# Altium schematic sheet PWR_PROT.SchDoc
size A4; SheetNumber: 5; SheetTotal: 6
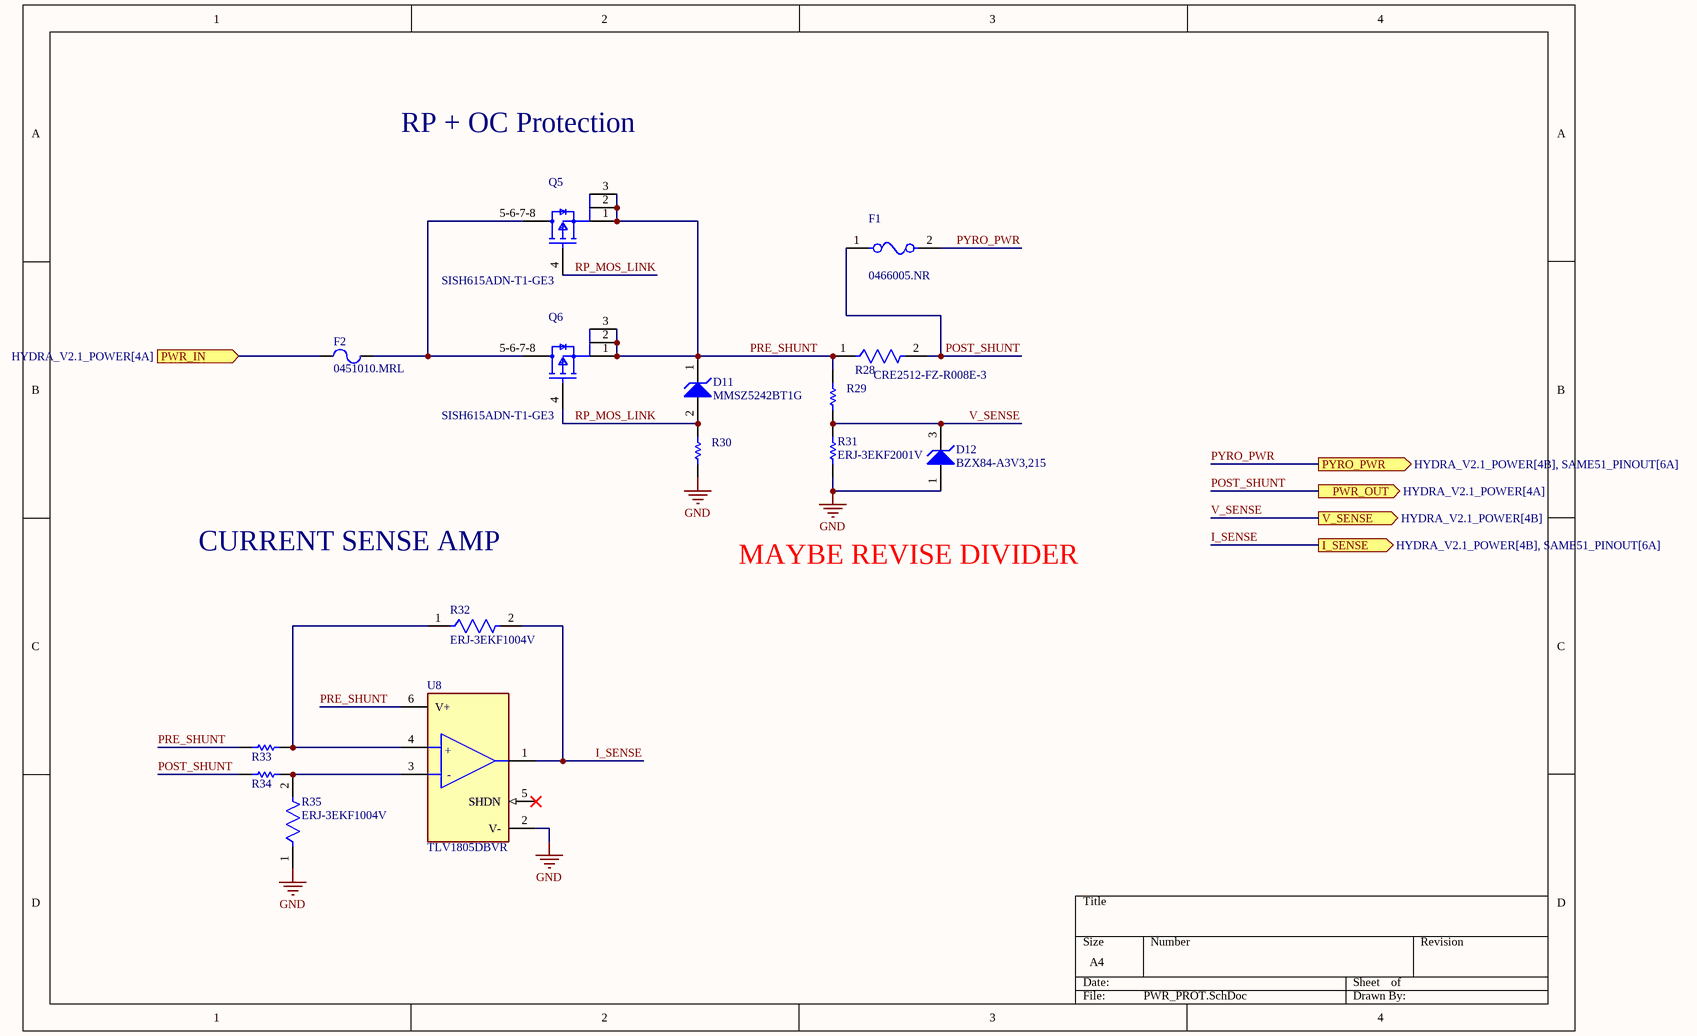
[diagram p0: PWR_PROT.SchDoc]

## Parts
D11  MMSZ5242BT1G  [ONSC-SOD-123-2-425-04_V]
D12  BZX84-A3V3,215  [SOT95P230X110-3N]
F1  0466005.NR  [FP-0466-MFG]
F2  0451010.MRL  [LFUS-45X_V]
Q5  SISH615ADN-T1-GE3  [SISH615ADN-T1-GE3-Footprint-1]
Q6  SISH615ADN-T1-GE3  [SISH615ADN-T1-GE3-Footprint-1]
R28  CRE2512-FZ-R008E-3  [CRF2512-FZ-R005ELF-Footprint-1]
R29  ERJ3EKF1002V  [RESC1609X55X30LL15T15]  (value not drawn)
R30  ERJ3EKF1002V  [RESC1609X55X30LL15T15]  (value not drawn)
R31  ERJ-3EKF2001V  [RESC1608X55X30ML15T15]
R32  ERJ-3EKF1004V  [FP-ERJ3EK-IPC_C]
R33  ERJ3EKF1002V  [RESC1609X55X30LL15T15]  (value not drawn)
R34  ERJ3EKF1002V  [RESC1609X55X30LL15T15]  (value not drawn)
R35  ERJ-3EKF1004V  [FP-ERJ3EK-IPC_C]
U8  TLV1805DBVR  [FP-DBV0006A-IPC_C]

## Ports
I_SENSE (out, see HYDRA_V2.1_POWER[4B], SAME51_PINOUT[6A]), PWR_IN (in, see HYDRA_V2.1_POWER[4A]), PWR_OUT (out, see HYDRA_V2.1_POWER[4A]), PYRO_PWR (out, see HYDRA_V2.1_POWER[4B], SAME51_PINOUT[6A]), V_SENSE (out, see HYDRA_V2.1_POWER[4B])

## Nets
GND: D12.1(A) R30.2 R31.1 R35.1 U8.2(V-)
I_SENSE: R32.2 U8.1(OUT) ; port I_SENSE
POST_SHUNT: F1.1 R28.2 R34.1 ; port PWR_OUT
PRE_SHUNT: D11.1(K) Q5.1(S) Q5.2(S) Q5.3(S) Q6.1(S) Q6.2(S) Q6.3(S) R28.1 R29.1 R33.1 U8.6(V+)
PWR_IN: F2.1 ; port PWR_IN
PYRO_PWR: F1.2 ; port PYRO_PWR
RP_MOS_LINK: D11.2(A) Q5.4(G) Q6.4(G) R30.1
V_SENSE: D12.3(K) R29.2 R31.2 ; port V_SENSE
NetF2_2: F2.2 Q5.5-6-7-8(D) Q6.5-6-7-8(D)
NetR32_1: R32.1 R33.2 U8.4(+IN)
NetR34_2: R34.2 R35.2 U8.3(-IN)

Not connected (* = marked no-connect by the designer): U8 5(SHDN)*

## Notes on the sheet
- RP + OC Protection
- CURRENT SENSE AMP
- MAYBE REVISE DIVIDER
- (in symbol CMP-04896-000098-1) +; -

## Library data of the parts
D11 = CMP-1060-00565-1: Zener Voltage Regulator, 500 mW, 2-Pin SOD-123, Pb-Free, Tape and Reel; Manufacturer: On Semiconductor; P Max (W): 0.5; VZ Typ (V): 12; PartNumber: MMSZ5242BT1G; PackageReference: SOD-123-2-425-04; ComponentLink3URL: http://www.onsemi.com/pub_link/Collateral/425-04.PDF; Mounting Technology: Surface Mount; ComponentLink2Description: Datasheet; ComponentLink1URL: http://www.onsemi.com/; ComponentLink3Description: Package Specification; PackageDescription: 2-Pin SOD, Body 1.6 x 2.69 mm; PackageVersion: Rev. G, 10/2009; ComponentLink1Description: Manufacturer URL; RoHS: Pb-Free; ComponentLink2URL: http://www.onsemi.com/pub_link/Collateral/MMSZ5221BT1-D.PDF; Packing: Tape and Reel; DatasheetVersion: Rev. 12
D12 = CMP-004-00035-1: DIODE ZENER 3.3V 250MW SOT23
F1 = CMP-08605-000032-1: FUSE BOARD MNT 5A 32VAC/VDC 1206; Manufacturer: Littelfuse Inc; Value: 0.011Ω; Max Fuse Ac Voltage: 32V; Fuse I2T: 2.5A2Sec; Fuse Interrupt Ac Current: 50A; Fuse Blow Speed: Fast; Fuse Voltage Drop: 73.75mV; Category: Fuse; Temperature: -55°C to +90°C; Lead Free: Yes; Temperature Range High: +90°C; RoHS: TRUE; Device Class L2: Fuses; ComponentLink2URL: https://www.littelfuse.com/~/media/electronics/datasheets/fuses/littelfuse_fuse_466_datasheet.pdf.pdf; Fuse Current: 5A; Octopart: https://octopart.com/0466005.nr-littelfuse-143206; Automotive: No; Max Fuse Dc Voltage: 32V; Temperature Range Low: -55°C; Device Class L3: unset; ComponentLink2Description: Datasheet; Manufacturer Part Number: 0466005.NR; Fuse Interrupt Dc Current: 50A; Resistance: 0.011Ω; Package: 0466; Device Class L1: Circuit Protection; Mouser Description: Surface Mount Fuses 32V 5A VFA Slimline; Height: 0.66mm; Voltage Rating: 32V; Digikey Description: FUSE BOARD MNT 5A 32VAC/VDC 1206
F2 = CMP-2000-05664-1: Fuse, 125 V, 10 A, -55 to 125 degC, 2-Pin SMD, RoHS, Tape and Reel; Manufacturer: Littelfuse; Working Voltage-Max: 125V; Response Characteristic: VeryFastActing; Current Rating: 10A; Manufacturer URL: http://www.littelfuse.com/; Mounting Technology: SurfaceMount; Size: 6.10x2.69mm; Operating Temp Range: -55to+125°C; Package Description: 2-Pin Surface Mount Device, Body 6.1 x 2.69 mm; Package Reference: 45X; Datasheet Version: 02/2016; Datasheet URL: http://www.littelfuse.com/products/fuses/surface-mount-fuses/nano-2-fuses/~/media/electronics/datasheets/fuses/littelfuse_fuse_451_453_datasheet.pdf.pdf
Q5 Q6 = CMP-013-00036-2: Trans MOSFET P-CH 20V 22.1A 8-Pin PowerPAK 1212 EP T/R
R28 = CMP-009-00183-1: Actually https://www.digikey.ca/en/products/detail/bourns-inc/CRE2512-FZ-R008E-3/4900057
R29 R30 R33 R34 = CMP-1012-00623-3: Chip Resistor, 10 KOhm, +/- 1%, 0.1 W, -55 to 155 degC, 0603 (1608 Metric), RoHS, Tape and Reel; Manufacturer: Panasonic; Voltage Rating: 75V; Case\/Package: 0603; Power Rating: 100mW; Resistance: 10KOhm; Temperature Coefficient: 100ppm\/degreesC; Number of Pins: 2; Package Reference: 603; Depth: 0.8mm; Mount: SurfaceMount; Package Description: 2-Pin Surface Mount Device, Body 1.6 x 0.85 mm; Datasheet Version: 02/2017; Length: 1.6mm; Lead Free: LeadFree; Height: 0.45mm; Number of Terminations: 2; Max Power Dissipation: 100mW; Min Operating Temperature: -55degC; Datasheet URL: https://industrial.panasonic.com/cdbs/www-data/pdf/RDA0000/AOA0000C304.pdf; Termination: SMD/SMT; Case Code (Metric): 1608; Case Code (Imperial): 0603; Tolerance: 1%; Max Operating Temperature: 155degC; RoHSCompliant: true; Voltage Rating (DC): 75V; Radiation Hardening: No; Packaging: TapeandReel; Composition: ThickFilm; Mounting Technology: SurfaceMount; Manufacturer URL: http://www.panasonic.com/; Width: 0.031inch; REACH SVHC: NoSVHC; Contact Plating: Tin; Military Standard: Not; Package Quantity: 1
R31 = CMP-2000-00317-1: Manufacturer: Panasonic; Part Number: ERJ-3EKF2001V
R32 R35 = CMP-1012-00849-3: RES SMD 1M OHM 1% 1/10W 0603; Resistance: 1MR; Voltage Rating: 75V; Temperature Coefficient: 100ppm/°C; Power Rating: 100mW; REACH SVHC: No SVHC; Radiation Hardening: No; Features: Automotive AEC-Q200; Case Code (Metric): 1608; Resistance Tolerance: 1%; Case/Package: 0603; Termination: SMD/SMT; Max Operating Temperature: 155°C; Tolerance: 1%; Size Code: 0603; Case Code (Imperial): 0603; Min Operating Temperature: -55°C; Number of Pins: 2; Mount: Surface Mount; Package Quantity: 1; Military Standard: Not; Voltage Rating (DC): 75V; Depth: 0.8mm; Packaging: Tape and Reel; Width: 0.8mm; Number of Terminations: 2; Length: 1.6mm; Height: 0.022inch; RoHS Compliant: Yes; Resistor Type: Thick Film; Contact Plating: Tin; Lead Free: Lead Free; Series: ERJ; Construction: Rectangular; Max Power Dissipation: 100mW
U8 = CMP-04896-000098-1: 40V, RAIL-TO-RAIL INPUT, PUSH-PU